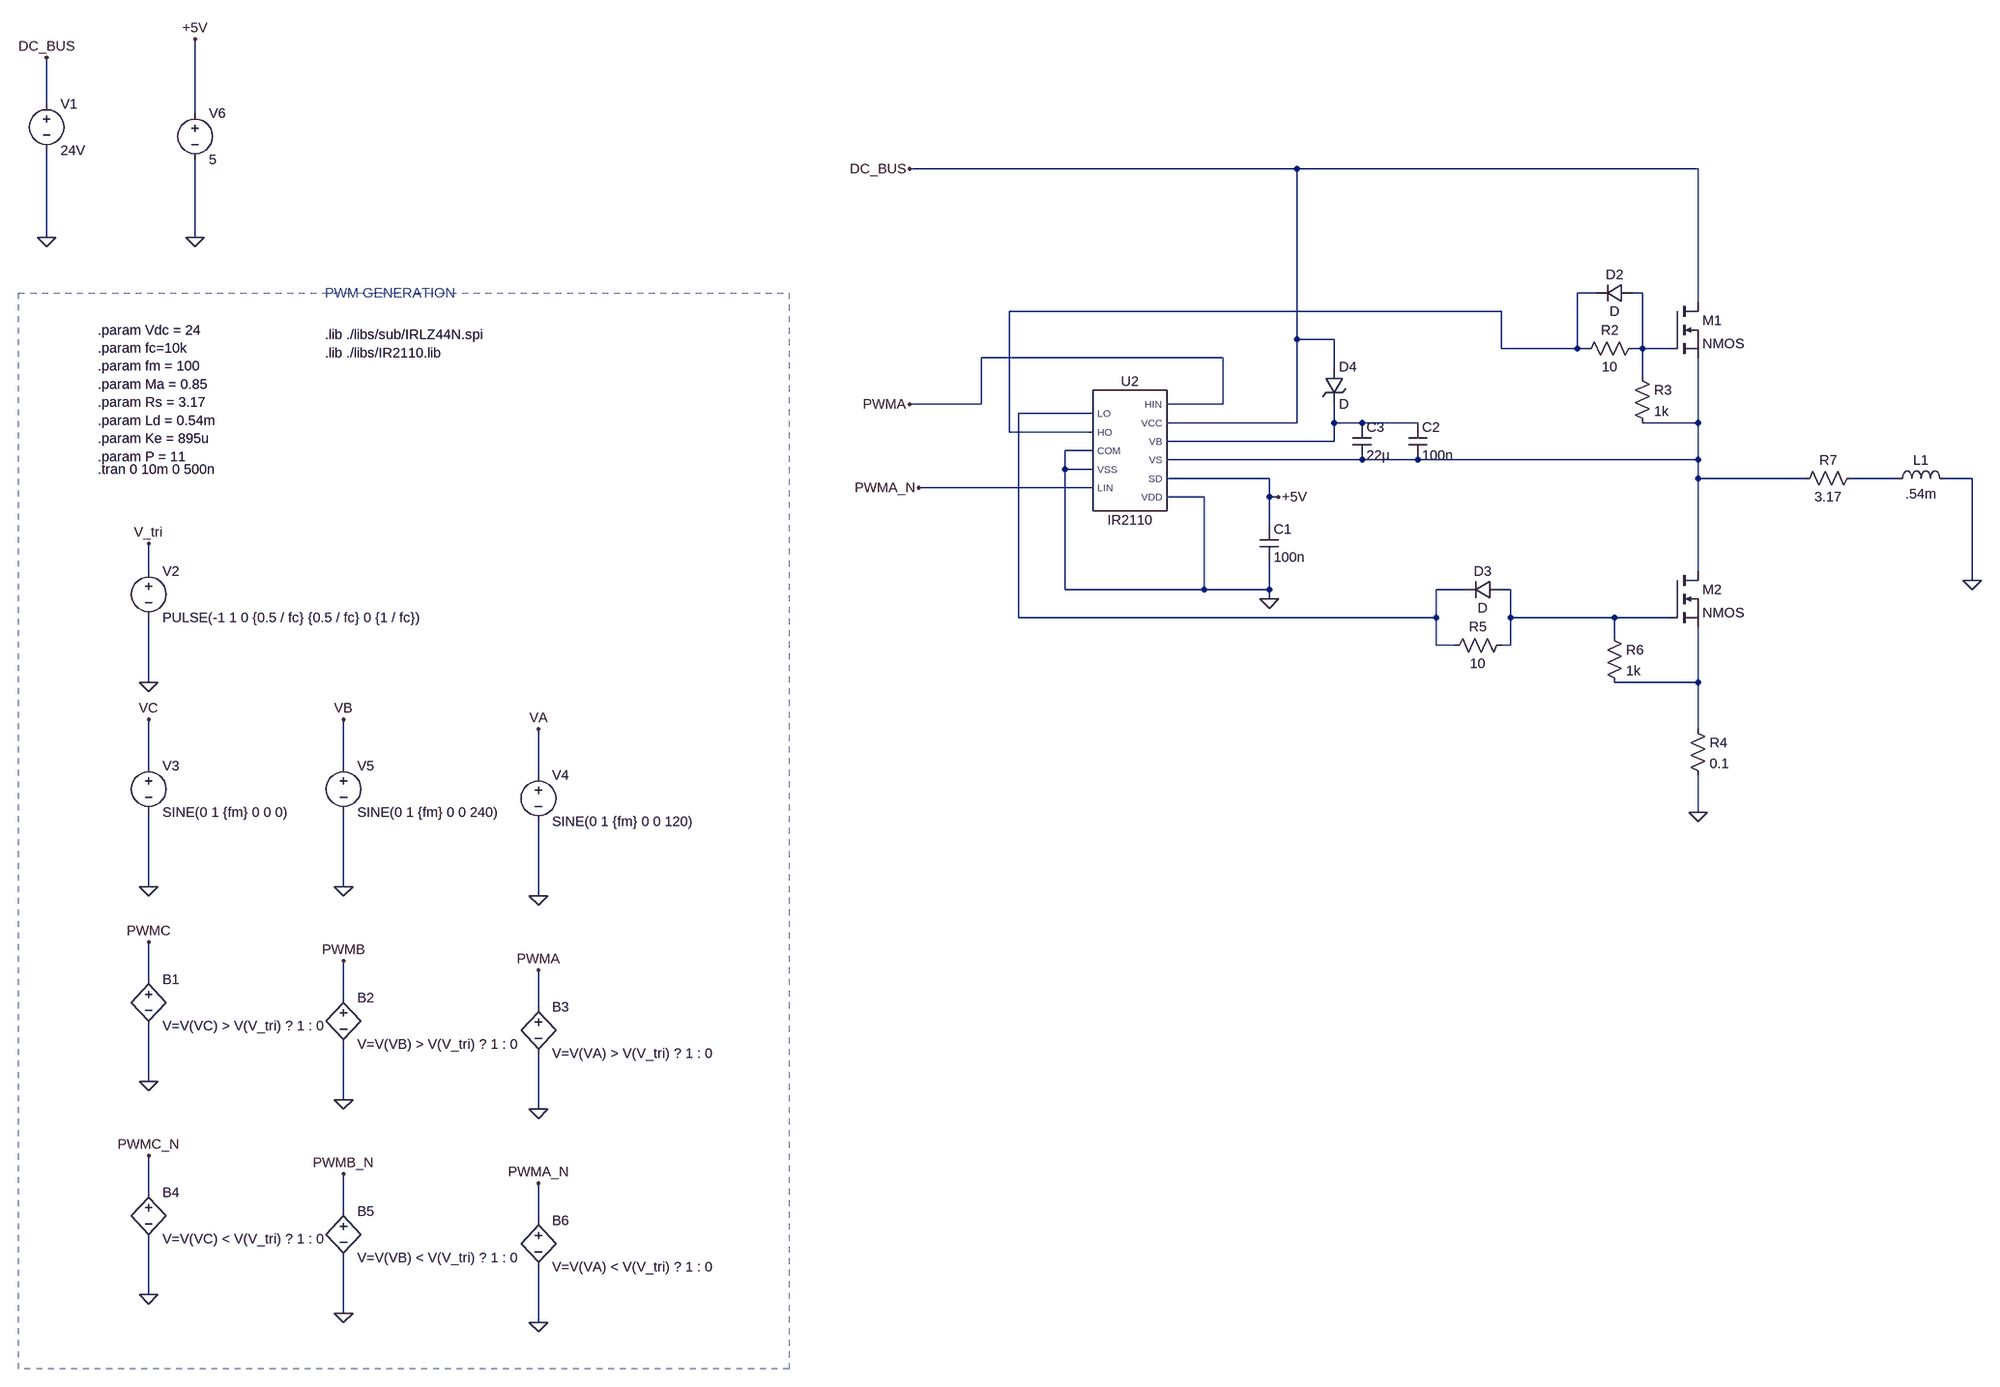
[diagram p0: schematic inverter_sim.asc]
inverter_sim.asc, the LTspice schematic file:
Version 4
SHEET 1 3748 2884
WIRE -192 368 -192 288
WIRE 64 384 64 256
WIRE 2224 480 1376 480
WIRE 2992 480 2224 480
WIRE -192 608 -192 448
WIRE 64 608 64 464
WIRE 2816 704 2784 704
WIRE 2896 704 2880 704
WIRE 2992 720 2992 480
WIRE 2576 736 1728 736
WIRE 2224 784 2224 480
WIRE 2288 784 2224 784
WIRE 2576 800 2576 736
WIRE 2784 800 2784 704
WIRE 2784 800 2576 800
WIRE 2800 800 2784 800
WIRE 2896 800 2896 704
WIRE 2896 800 2880 800
WIRE 2944 800 2896 800
WIRE 2096 816 1680 816
WIRE 2288 832 2288 784
WIRE 2896 848 2896 800
WIRE 1680 896 1680 816
WIRE 1680 896 1376 896
WIRE 2096 896 2096 816
WIRE 2096 896 2000 896
WIRE 1872 912 1744 912
WIRE 2224 928 2224 784
WIRE 2224 928 2000 928
WIRE 2288 928 2288 896
WIRE 2336 928 2288 928
WIRE 2432 928 2336 928
WIRE 2992 928 2992 816
WIRE 2992 928 2896 928
WIRE 1728 944 1728 736
WIRE 1872 944 1728 944
WIRE 2288 960 2288 928
WIRE 2288 960 2000 960
WIRE 1872 976 1824 976
WIRE 2336 992 2000 992
WIRE 2432 992 2336 992
WIRE 2992 992 2992 928
WIRE 2992 992 2432 992
WIRE 1824 1008 1824 976
WIRE 1872 1008 1824 1008
WIRE 2176 1024 2000 1024
WIRE 2992 1024 2992 992
WIRE 3440 1024 2992 1024
WIRE 3600 1024 3520 1024
WIRE 3728 1024 3680 1024
WIRE 1872 1040 1392 1040
WIRE 2064 1056 2000 1056
WIRE 2176 1056 2176 1024
WIRE 2192 1056 2176 1056
WIRE 2176 1104 2176 1056
WIRE -16 1184 -16 1136
WIRE 2992 1184 2992 1024
WIRE 3728 1200 3728 1024
WIRE 1824 1216 1824 1008
WIRE 2064 1216 2064 1056
WIRE 2064 1216 1824 1216
WIRE 2176 1216 2176 1168
WIRE 2176 1216 2064 1216
WIRE 2512 1216 2464 1216
WIRE 2592 1216 2576 1216
WIRE 2176 1232 2176 1216
WIRE 1744 1264 1744 912
WIRE 2464 1264 2464 1216
WIRE 2464 1264 1744 1264
WIRE 2592 1264 2592 1216
WIRE 2848 1264 2592 1264
WIRE 2944 1264 2848 1264
WIRE 2848 1296 2848 1264
WIRE 2464 1312 2464 1264
WIRE 2496 1312 2464 1312
WIRE 2592 1312 2592 1264
WIRE 2592 1312 2576 1312
WIRE -16 1376 -16 1264
WIRE 2992 1376 2992 1280
WIRE 2992 1376 2848 1376
WIRE 2992 1456 2992 1376
WIRE -16 1520 -16 1440
WIRE 320 1520 320 1440
WIRE 656 1536 656 1456
WIRE 2992 1600 2992 1536
WIRE -16 1728 -16 1600
WIRE 320 1728 320 1600
WIRE 656 1744 656 1616
WIRE -16 1888 -16 1824
WIRE 320 1920 320 1856
WIRE 656 1936 656 1872
WIRE -16 2064 -16 1968
WIRE 320 2096 320 2000
WIRE 656 2112 656 2016
WIRE -16 2256 -16 2192
WIRE 320 2288 320 2224
WIRE 656 2304 656 2240
WIRE -16 2432 -16 2336
WIRE 320 2464 320 2368
WIRE 656 2480 656 2384
FLAG -16 1136 V_tri
FLAG -16 1376 0
FLAG -16 1728 0
FLAG -16 1440 VC
FLAG 656 1744 0
FLAG 656 1456 VA
FLAG 320 1728 0
FLAG 320 1440 VB
FLAG -16 2064 0
FLAG -16 1824 PWMC
FLAG 320 2096 0
FLAG 320 1856 PWMB
FLAG 656 2112 0
FLAG 656 1872 PWMA
FLAG -16 2432 0
FLAG -16 2192 PWMC_N
FLAG 320 2464 0
FLAG 320 2224 PWMB_N
FLAG 656 2480 0
FLAG 656 2240 PWMA_N
FLAG 1376 896 PWMA
FLAG 1392 1040 PWMA_N
FLAG 64 608 0
FLAG -192 608 0
FLAG -192 288 DC_BUS
FLAG 64 256 +5V
FLAG 2192 1056 +5V
FLAG 2176 1232 0
FLAG 1376 480 DC_BUS
FLAG 2992 1600 0
FLAG 3728 1200 0
SYMBOL voltage -16 1168 R0
WINDOW 123 0 0 Left 0
WINDOW 39 0 0 Left 0
SYMATTR InstName V2
SYMATTR Value PULSE(-1 1 0 {0.5 / fc} {0.5 / fc} 0 {1 / fc})
SYMBOL voltage -16 1504 R0
WINDOW 123 0 0 Left 0
WINDOW 39 0 0 Left 0
SYMATTR InstName V3
SYMATTR Value SINE(0 1 {fm} 0 0 0)
SYMBOL voltage 656 1520 R0
WINDOW 123 0 0 Left 0
WINDOW 39 0 0 Left 0
SYMATTR InstName V4
SYMATTR Value SINE(0 1 {fm} 0 0 120)
SYMBOL voltage 320 1504 R0
WINDOW 123 0 0 Left 0
WINDOW 39 0 0 Left 0
SYMATTR InstName V5
SYMATTR Value SINE(0 1 {fm} 0 0 240)
SYMBOL bv -16 1872 R0
SYMATTR InstName B1
SYMATTR Value V=V(VC) > V(V_tri) ? 1 : 0
SYMBOL bv 320 1904 R0
SYMATTR InstName B2
SYMATTR Value V=V(VB) > V(V_tri) ? 1 : 0
SYMBOL bv 656 1920 R0
SYMATTR InstName B3
SYMATTR Value V=V(VA) > V(V_tri) ? 1 : 0
SYMBOL bv -16 2240 R0
SYMATTR InstName B4
SYMATTR Value V=V(VC) < V(V_tri) ? 1 : 0
SYMBOL bv 320 2272 R0
SYMATTR InstName B5
SYMATTR Value V=V(VB) < V(V_tri) ? 1 : 0
SYMBOL bv 656 2288 R0
SYMATTR InstName B6
SYMATTR Value V=V(VA) < V(V_tri) ? 1 : 0
SYMBOL voltage -192 352 R0
WINDOW 123 0 0 Left 0
WINDOW 39 0 0 Left 0
SYMATTR InstName V1
SYMATTR Value 24V
SYMBOL voltage 64 368 R0
WINDOW 123 0 0 Left 0
WINDOW 39 0 0 Left 0
SYMATTR InstName V6
SYMATTR Value 5
SYMBOL cap 2160 1104 R0
SYMATTR InstName C1
SYMATTR Value 100n
SYMBOL cap 2416 928 R0
SYMATTR InstName C2
SYMATTR Value 100n
SYMBOL cap 2320 928 R0
SYMATTR InstName C3
SYMATTR Value 22µ
SYMBOL res 2896 784 R90
WINDOW 0 0 56 VBottom 2
WINDOW 3 32 56 VTop 2
SYMATTR InstName R2
SYMATTR Value 10
SYMBOL diode 2880 688 R90
WINDOW 0 0 32 VBottom 2
WINDOW 3 32 32 VTop 2
SYMATTR InstName D2
SYMBOL res 2880 832 R0
SYMATTR InstName R3
SYMATTR Value 1k
SYMBOL nmos 2944 720 R0
SYMATTR InstName M1
SYMBOL nmos 2944 1184 R0
SYMATTR InstName M2
SYMBOL res 2976 1440 R0
SYMATTR InstName R4
SYMATTR Value 0.1
SYMBOL diode 2576 1200 R90
WINDOW 0 0 32 VBottom 2
WINDOW 3 32 32 VTop 2
SYMATTR InstName D3
SYMBOL res 2592 1296 R90
WINDOW 0 0 56 VBottom 2
WINDOW 3 32 56 VTop 2
SYMATTR InstName R5
SYMATTR Value 10
SYMBOL res 2832 1280 R0
SYMATTR InstName R6
SYMATTR Value 1k
SYMBOL zener 2272 832 R0
SYMATTR InstName D4
SYMBOL res 3536 1008 R90
WINDOW 0 0 56 VBottom 2
WINDOW 3 32 56 VTop 2
SYMATTR InstName R7
SYMATTR Value 3.17
SYMBOL ind 3584 1040 R270
WINDOW 0 32 56 VTop 2
WINDOW 3 5 56 VBottom 2
SYMATTR InstName L1
SYMATTR Value .54m
SYMBOL IR2110 1936 976 R0
SYMATTR InstName U2
TEXT -104 768 Left 2 !.param Vdc = 24\n.param fc=10k\n.param fm = 100\n.param Ma = 0.85\n.param Rs = 3.17\n.param Ld = 0.54m\n.param Ke = 895u\n.param P = 11
TEXT -104 1008 Left 2 !.tran 0 10m 0 500n
TEXT 288 704 Left 2 ;PWM GENERATION
TEXT 288 776 Left 2 !.lib ./libs/sub/IRLZ44N.spi\n.lib ./libs/IR2110.lib
RECTANGLE Normal 1088 2560 -240 704 2

The netlist it stands for:
* inverter_sim.asc
V2 V_tri 0 PULSE(-1 1 0 {0.5 / fc} {0.5 / fc} 0 {1 / fc})
V3 VC 0 SINE(0 1 {fm} 0 0 0)
V4 VA 0 SINE(0 1 {fm} 0 0 120)
V5 VB 0 SINE(0 1 {fm} 0 0 240)
B1 PWMC 0 V=V(VC) > V(V_tri) ? 1 : 0
B2 PWMB 0 V=V(VB) > V(V_tri) ? 1 : 0
B3 PWMA 0 V=V(VA) > V(V_tri) ? 1 : 0
B4 PWMC_N 0 V=V(VC) < V(V_tri) ? 1 : 0
B5 PWMB_N 0 V=V(VB) < V(V_tri) ? 1 : 0
B6 PWMA_N 0 V=V(VA) < V(V_tri) ? 1 : 0
V1 DC_BUS 0 24V
V6 +5V 0 5
C1 +5V 0 100n
C2 N004 N005 100n
C3 N004 N005 22µ
R2 N002 N001 10
D2 N002 N001 D
R3 N002 N005 1k
M1 DC_BUS N002 N005 N005 NMOS
M2 N005 N007 N008 N008 NMOS
R4 N008 0 0.1
D3 N007 N003 D
R5 N007 N003 10
R6 N007 N008 1k
D4 DC_BUS N004 D
R7 N006 N005 3.17
L1 N006 0 .54m
XU2 N003 N001 0 0 PWMA_N PWMA DC_BUS N004 N005 +5V 0 IR2110  ; pins LO HO COM VSS LIN HIN VCC VB VS SD VDD
.model D D
.lib standard.dio
.model NMOS NMOS
.model PMOS PMOS
.lib standard.mos
.param Vdc = 24
.param fc=10k
.param fm = 100
.param Ma = 0.85
.param Rs = 3.17
.param Ld = 0.54m
.param Ke = 895u
.param P = 11
.tran 0 10m 0 500n
* PWM GENERATION
.lib ./libs/sub/IRLZ44N.spi
.lib ./libs/IR2110.lib
.lib C:\Users\abdab\Documents\Capstone\BLDC-motor-custom-inverter\SPICE\libs\IR2110.lib
.backanno
.end